# EAGLE design Spectra Mirror Top Board Final (EAGLE 6.5.0)
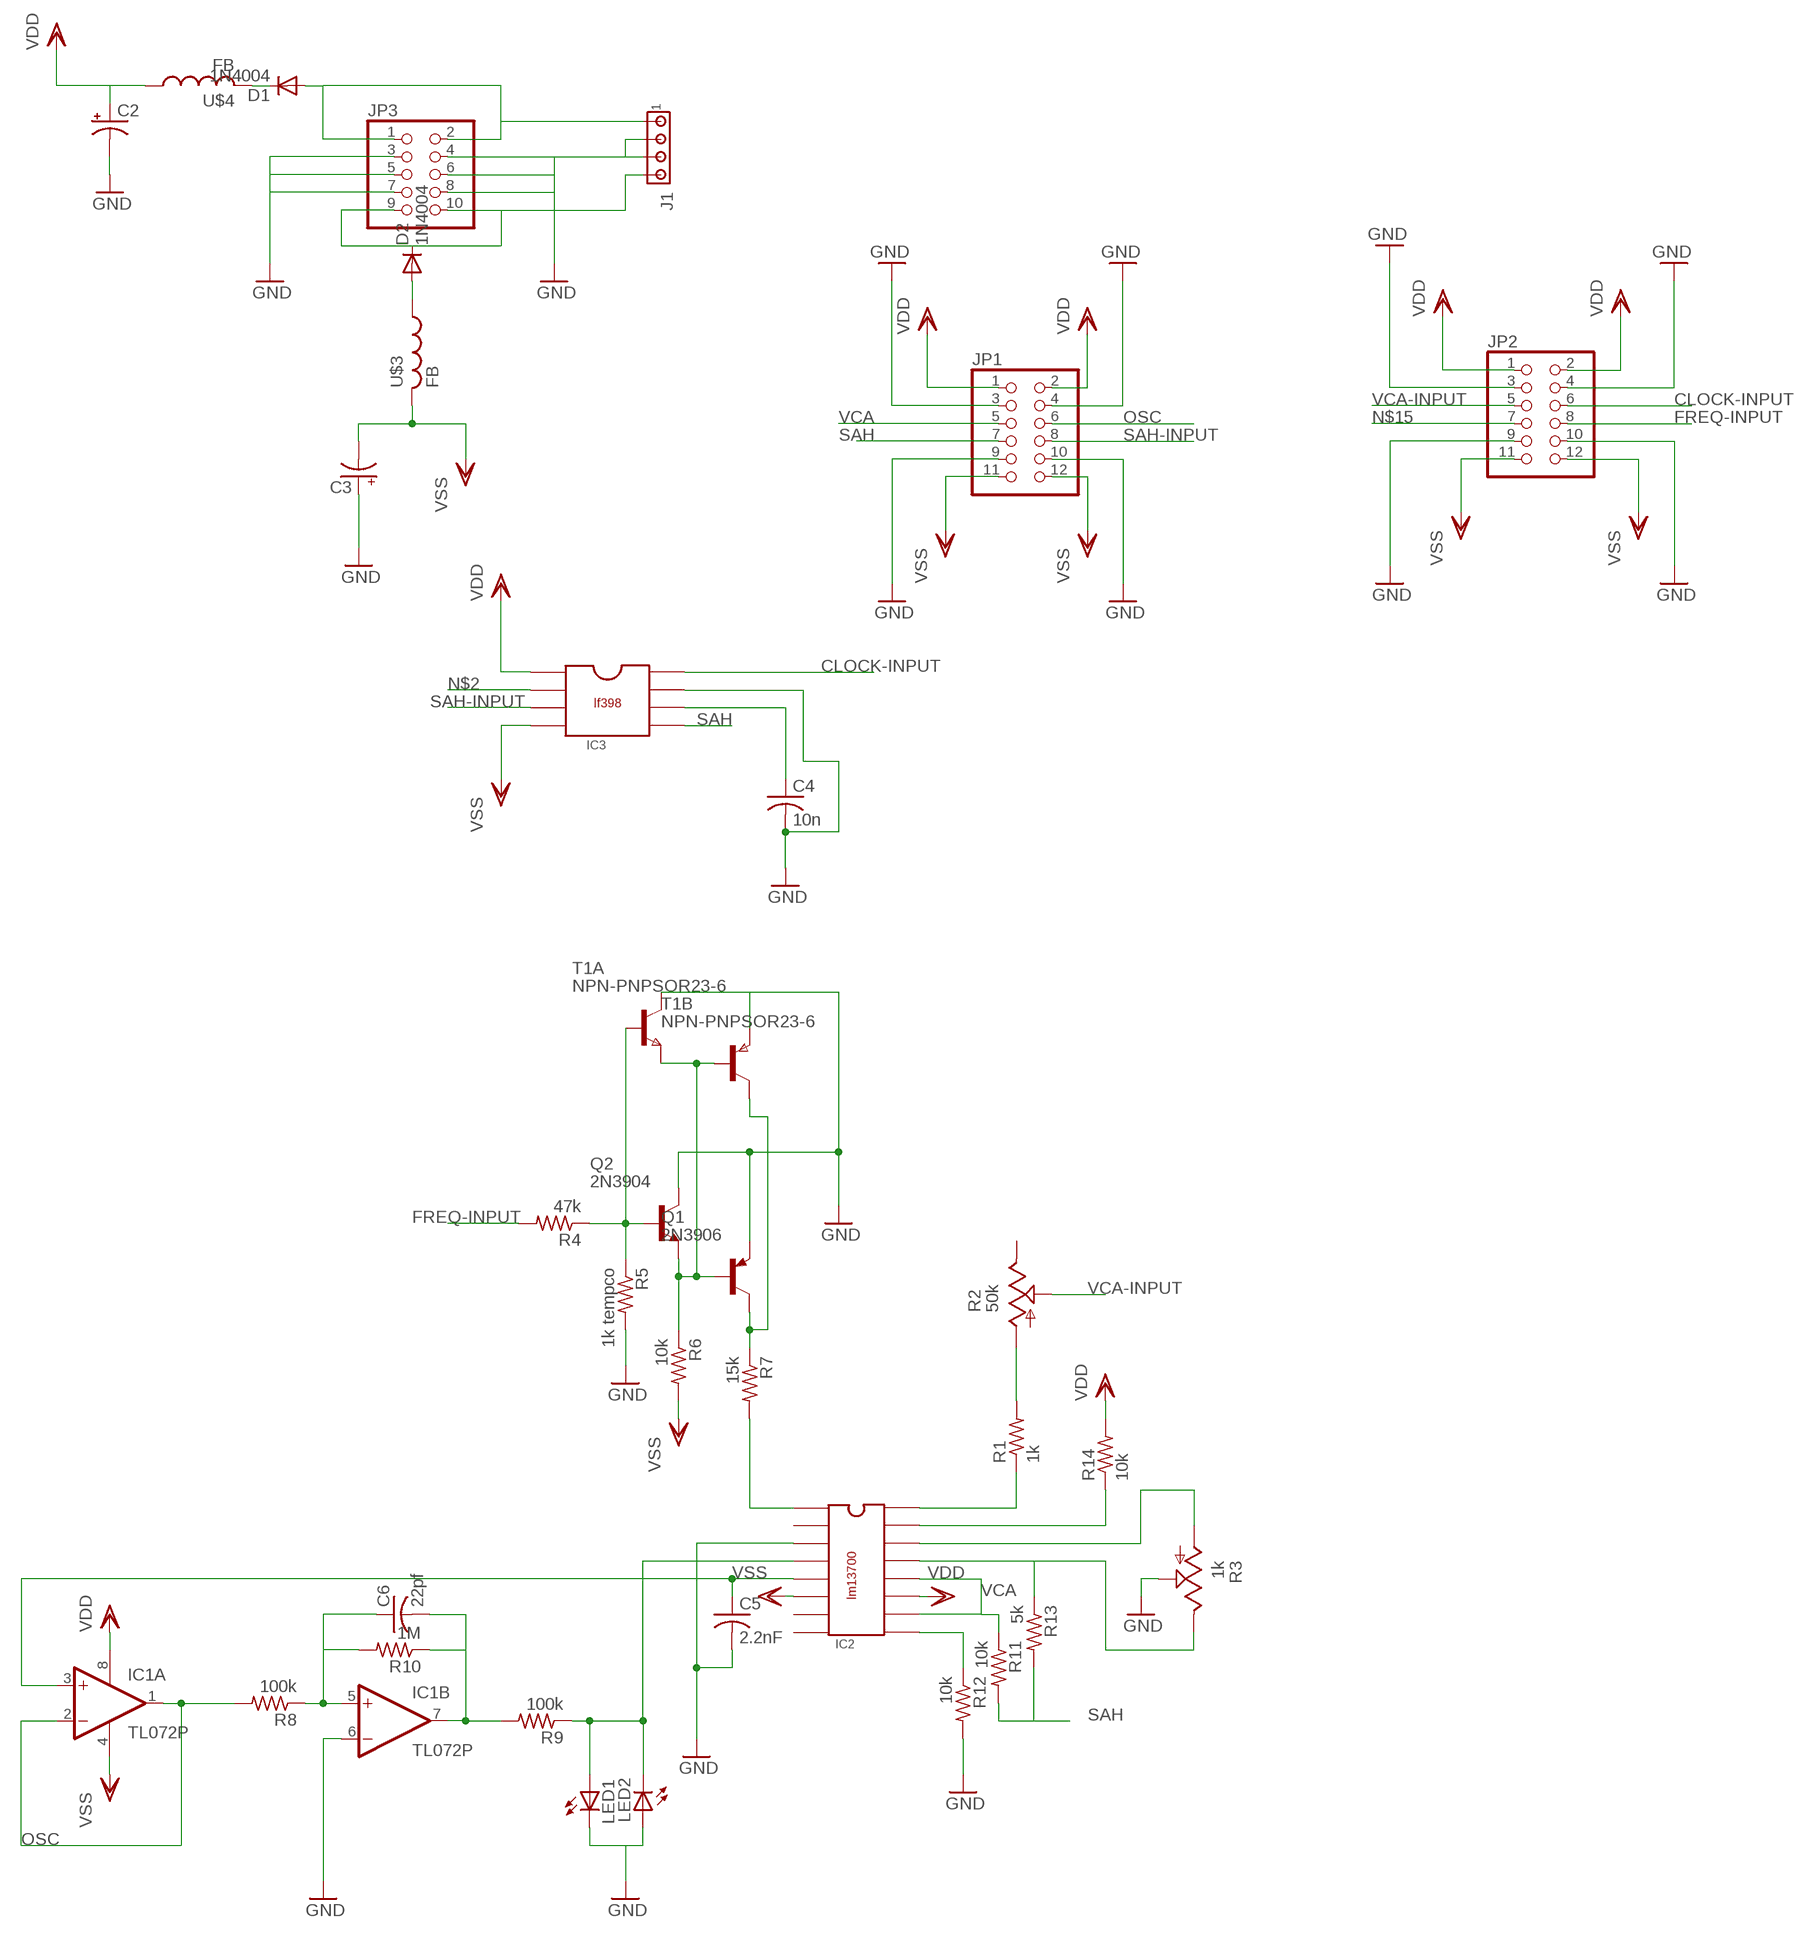
[diagram p0: schematic, sheet 1]

## Parts
C2  CPOL-USE2.5-5  [E2,5-5]
C3  CPOL-USE2.5-5  [E2,5-5]
C4  10n  C-US050-024X044  [C050-024X044]
C5  2.2nF  C-US050-024X044  [C050-024X044]
C6  22pf  C-US050-024X044  [C050-024X044]
D1  1N4004  [DO41-10]
D2  1N4004  [DO41-10]
IC1  TL072P  [DIL08]
IC2  LM13700  [DIL16]
IC3  LF398  [DIL08]
J1  MTA04-156  [1X4MTA]
JP1  PINHD-2X6  [2X06]
JP2  PINHD-2X6  [2X06]
JP3  PINHD-2X5  [2X05]
LED1  LED3MM  [LED3MM]
LED2  LED3MM  [LED3MM]
Q1  2N3906  [TO92]
Q2  2N3904  [TO92]
R1  1k  R-US_0204/7  [0204/7]
R2  50k  TRIM_US-B64Y  [B64Y]
R3  1k  TRIM_US-B64Y  [B64Y]
R4  47k  R-US_0204/7  [0204/7]
R5  1k tempco  R-US_0204/7  [0204/7]
R6  10k  R-US_0204/7  [0204/7]
R7  15k  R-US_0204/7  [0204/7]
R8  100k  R-US_0204/7  [0204/7]
R9  100k  R-US_0204/7  [0204/7]
R10  1M  R-US_0204/7  [0204/7]
R11  10k  R-US_0204/7  [0204/7]
R12  10k  R-US_0204/7  [0204/7]
R13  5k  R-US_0204/7  [0204/7]
R14  10k  R-US_0204/7  [0204/7]
T1  NPN-PNPSOR23-6  [SOT23-6]
U$3  FB  [FB]
U$4  FB  [FB]

## Nets
CLOCK-INPUT: IC3.8 JP2.6
FREQ-INPUT: JP2.8 R4.2
GND: C2.- C3.+ C4.2 C5.2 IC1.6(B:-IN) IC2.3 IC3.7 J1.2 J1.3 JP1.3 JP1.4 JP1.9 JP1.10 JP2.3 JP2.4 JP2.9 JP2.10 JP3.3 JP3.4 JP3.5 JP3.6 JP3.7 JP3.8 LED1.K(C) LED2.A Q1.3(E) Q2.1(C) R3.S R5.2 R12.2 T1.1(A:C) T1.4(B:E)
N$1: D1.A J1.1 JP3.1 JP3.2
N$2: IC3.2
N$3: Q1.2(B) Q2.3(E) R6.1 T1.5(B:B) T1.6(A:E)
N$4: Q2.2(B) R4.1 R5.1 T1.2(A:B)
N$5: C4.1 IC3.6
N$6: C6.1 IC1.5(B:+IN) R8.1 R10.2
N$8: Q1.1(C) R7.1 T1.3(B:C)
N$9: IC2.1 R7.2
N$10: IC2.4 LED1.A LED2.K(C) R9.1
N$11: C6.2 IC1.7(B:OUT) R9.2 R10.1
N$12: D2.C J1.4 JP3.9 JP3.10
N$13: C5.1 IC1.3(A:+IN) IC2.5
N$14: IC2.9 R12.1
N$15: JP2.7
N$16: IC2.13 R3.E R13.1
N$17: IC2.14 R3.A
N$18: IC2.15 R14.1
N$19: IC2.16 R1.1
N$20: R1.2 R2.A
N$21: D1.C U$4.P$2
N$22: D2.A U$3.P$1
OSC: IC1.1(A:OUT) IC1.2(A:-IN) JP1.6 R8.2
SAH: IC3.5 JP1.7 R11.2 R13.2
SAH-INPUT: IC3.3 JP1.8
VCA: IC2.10 IC2.12 JP1.5 R11.1
VCA-INPUT: JP2.5 R2.S
VDD: C2.+ IC1.8(P:V+) IC2.11 IC3.1 JP1.1 JP1.2 JP2.1 JP2.2 R14.2 U$4.P$1
VSS: C3.- IC1.4(P:V-) IC2.6 IC3.4 JP1.11 JP1.12 JP2.11 JP2.12 R6.2 U$3.P$2
Unconnected: IC2.2 IC2.7 IC2.8 R2.E

## Library data of the parts
C2 C3 = rcl:CPOL-US: POLARIZED CAPACITOR, American symbol
C4-C6 = rcl:C-US: CAPACITOR, American symbol
D1 D2 = diode:1N4004: DIODE general purpose rectifier, 1 A
IC1 = linear:TL072: OP AMP
IC2 = elipech_modified:LM13700
IC3 = elipech_modified:LF398
J1 = con-amp:MTA04-156: AMP connector
JP1 JP2 = pinhead:PINHD-2X6: PIN HEADER
JP3 = pinhead:PINHD-2X5: PIN HEADER
LED1 LED2 = adafruit:LED: LED OSRAM: - CHIPLED LG R971, LG N971, LY N971, LG Q971, LY Q971, LO R971, LY R971 LH N974, LH R974 LS Q976, LO Q976, LY Q976 LO Q996 - Hyper CHIPLED LW Q18S LB Q993, LB Q99A, LB R99A - SideLED LS A670, LO A670, LY A670, LG A670, LP A670 LB A673, LV A673, LT A673, LW A673 LH A674 LY A675 LS A676, LA A676, LO A676, LY A676, LW A676 LS A679, LY A679, LG A679 - Hyper Micro SIDELED® LS Y876, LA Y876, LO Y876, LY Y876 LT Y87S - SmartLED LW L88C, LW L88S LB L89C, LB L89S, LG L890 LS L89K, LO L89K, LY L89K LS L896, LA L896, LO L896, LY L896 - TOPLED LS T670, LO T670, LY T670, LG T670, LP T670 LSG T670, LSP T670, LSY T670, LOP T670, LYG T670 LG T671, LOG T671, LSG T671 LB T673, LV T673, LT T673, LW T673 LH T674 LS T676, LA T676, LO T676, LY T676, LB T676, LH T676, LSB T676, LW T676 LB T67C, LV T67C, LT T67C, LS T67K, LO T67K, LY T67K, LW E67C LS E67B, LA E67B, LO E67B, LY E67B, LB E67C, LV E67C, LT E67C LW T67C LS T679, LY T679, LG T679 LS T770, LO T770, LY T770, LG T770, LP T770 LB T773, LV T773, LT T773, LW T773 LH T774 LS E675, LA E675, LY E675, LS T675 LS T776, LA T776, LO T776, LY T776, LB T776 LHGB T686 LT T68C, LB T68C - Hyper Mini TOPLED® LB M676 - Mini TOPLED Santana® LG M470 LS M47K, LO M47K, LY M47K Source: http://www.osram.convergy.de/
Q1 = transistor-pnp:2N3906: PNP Transistor
Q2 = transistor:2N3904: NPN TRANSISTOR
R1 R4-R14 = rcl:R-US_: RESISTOR, American symbol
R2 R3 = pot:TRIM_US-: POTENTIOMETER
T1 = zetex:NPN-PNPSOR23-6: Dual NPN PNP TRANSISTOR; OC_FARNELL: unknown; OC_NEWARK: unknown
U$3 U$4 = adafruit:FB: Ferrite bead Digikey #P9821BK-ND

## Board
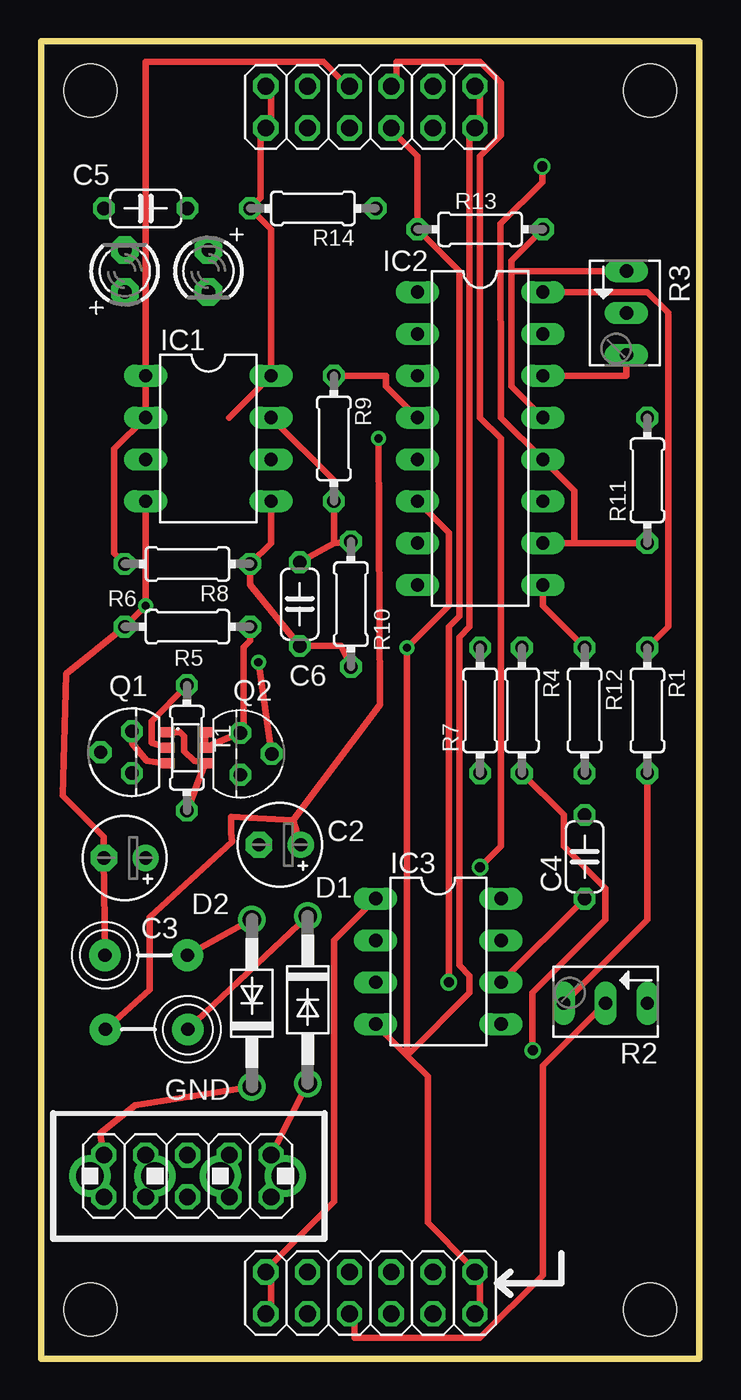
[diagram p1: board, top side]
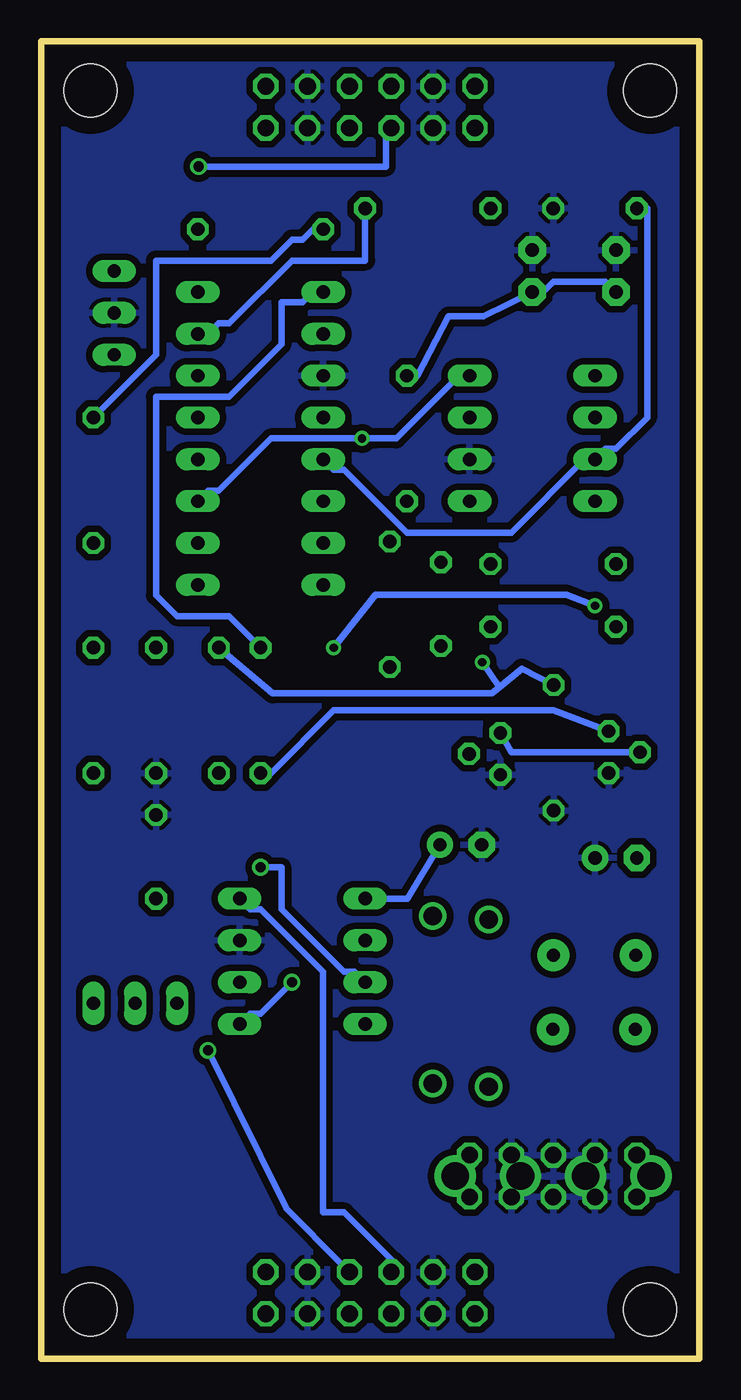
[diagram p2: board, bottom side, seen from below]

Size 40 x 80 mm. Coordinates in mm from the lower left corner, seen from the top.
Outline: 0,0 40,0 40,80 0,80 0,0
Copper layers (1*16): Top 0.035mm / dielectric 1.5mm / Bottom 0.035mm
Design rules "default *": minimum track width 10mil, minimum drill 24mil, track to track 8mil, track to pad 8mil, pad to pad 8mil, via to via 8mil, smd to smd 8mil, copper to edge 40mil, drill to drill 8mil, minimum pad ring 10mil, minimum via ring 8mil, stop-mask expansion 4mil, vias tented up to drill 25mil, thermal gap 10mil
Holes 3.2 mm at 3,3 37,3 3,77 37,77

### Footprints (pad centres in the part's own frame; a part is rotated, then mirrored left to right if it is on the bottom)
E2,5-5 = drill 0.813 pad 1.6: + -1.27,0 | drill 0.813 pad 1.6 octagon: - 1.27,0
C050-024X044 = drill 0.813 octagon: 1 -2.54,0; 2 2.54,0
DO41-10 = drill 1.118: A 5.08,0; C -5.08,0
DIL08 = drill 0.813 pad 1.27 long: 1 -3.81,-3.81; 2 -1.27,-3.81; 3 1.27,-3.81; 4 3.81,-3.81; 5 3.81,3.81; 6 1.27,3.81; 7 -1.27,3.81; 8 -3.81,3.81
DIL16 = drill 0.813 long: 1 -8.89,-3.81; 2 -6.35,-3.81; 3 -3.81,-3.81; 4 -1.27,-3.81; 5 1.27,-3.81; 6 3.81,-3.81; 7 6.35,-3.81; 8 8.89,-3.81; 9 8.89,3.81; 10 6.35,3.81; 11 3.81,3.81; 12 1.27,3.81; 13 -1.27,3.81; 14 -3.81,3.81; 15 -6.35,3.81; 16 -8.89,3.81
1X4MTA = drill 1.676: 1 5.944,0; 2 1.981,0; 3 -1.981,0; 4 -5.944,0
2X06 = drill 1.016 octagon: 1 -6.35,-1.27; 2 -6.35,1.27; 3 -3.81,-1.27; 4 -3.81,1.27; 5 -1.27,-1.27; 6 -1.27,1.27; 7 1.27,-1.27; 8 1.27,1.27; 9 3.81,-1.27; 10 3.81,1.27; 11 6.35,-1.27; 12 6.35,1.27
2X05 = drill 1.016 octagon: 1 -5.08,-1.27; 2 -5.08,1.27; 3 -2.54,-1.27; 4 -2.54,1.27; 5 0,-1.27; 6 0,1.27; 7 2.54,-1.27; 8 2.54,1.27; 9 5.08,-1.27; 10 5.08,1.27
LED3MM = drill 0.813 pad 1.676 octagon: A -1.27,0; K 1.27,0
TO92 = drill 0.813 octagon: 1 1.27,0; 2 0,1.905; 3 -1.27,0
0204/7 = drill 0.813 octagon: 1 -3.81,0; 2 3.81,0
B64Y = drill 0.813 long: A 2.54,0; E -2.54,0; S 0,0
SOT23-6 = smd 0.6 x 0.9: 1 -0.95,-1.15; 2 0,-1.15; 3 0.95,-1.15; 4 0.95,1.15; 5 0,1.15; 6 -0.95,1.15
FB = drill 0.8 pad 1.93: P$1 -2.5,0; P$2 2.5,0

### Placement (x,y rotation side)
C2  14.5,31.21 180 top
C3  5.08,30.41 180 top
C4  33.02,30.48 90 top
C5  6.35,69.85 0 top
C6  15.71,45.82 90 top
D1  16.2,21.8 270 top
D2  12.8,21.6 90 top
IC1  10.16,55.88 270 top
IC2  26.67,55.88 270 top
IC3  24.13,24.13 270 top
J1  8.9,11.1 0 top
JP1  20,76 0 top
JP2  20,4 0 top
JP3  8.89,11.1 180 top
LED1  5.08,66.04 90 top
LED2  10.16,66.04 270 top
Q1  5.52,36.83 90 top
Q2  12.1,36.73 270 top
R1  36.83,39.37 270 top
R2  34.29,21.59 180 top
R3  35.56,63.5 270 top
R4  29.21,39.37 270 top
R5  8.86,37.1 270 top
R6  8.89,44.45 180 top
R7  26.67,39.37 90 top
R8  8.89,48.26 180 top
R9  17.78,55.88 270 top
R10  18.82,45.82 270 top
R11  36.83,53.34 90 top
R12  33.02,39.37 270 top
R13  26.67,68.58 180 top
R14  16.51,69.85 180 top
T1  8.8,37.1 270 top
U$3  6.38,24.51 180 top
U$4  6.41,20 0 top

### Tracks (layer width: path | path; a pad name or v marks a point on that pad's centre or on a via)
CLOCK-INPUT
  Bottom 0.406: IC3.8 27.3,27.3 26.67,27.3 22.86,23.5 22.86,8.89 21.59,8.89 18.41,5.71 JP2.6
FREQ-INPUT  (via drill 0.61)
  Top 0.406: R4.2 31.75,33.02 31.75,31.11 34.29,28.57 34.29,26.67 29.84,22.23 29.84,19.2 v29.86,18.73
  Bottom 0.406: v29.86,18.73 25.1,9.1 21.71,5.71 20.95,5.71 JP2.8
GND
  Top 0.406: R5.2 T1.4 9.3,36.3 8.7,36.9 8.7,37.8 8.45,38.05 T1.1
  pour Bottom (isolate 0.406): -5.08,82.55 -5.08,-3.81 54.61,-3.81 54.61,24.13 54.61,83.82 -5.08,83.82
N$1
  Top 0.406: JP3.1 JP3.2 | D1.A JP3.1 | JP3.1 J1.1
N$3
  Top 0.406: R6.1 12.7,43.6 12.3,43.2 12.3,38.5 Q2.3 T1.5 T1.6
  Bottom 0.406: Q1.2 11.43,36.83 Q2.3
N$4  (via drill 0.5)
  Top 0.406: Q2.2 v13.2,42.3 | R5.1 6.7,38.7 6.7,37.4 T1.2
  Bottom 0.406: R4.1 25.93,40.41 12.6,40.41 12.15,40.78 | 12.15,40.78 10.79,41.91 R5.1 | v13.2,42.3 12.15,40.78
N$5
  Top 0.406: C4.1 IC3.6
N$6
  Top 0.406: R10.2 18.22,43.28 C6.1 12.7,46.99 R8.1 13.97,49.53 IC1.5
N$8
  Top 0.406: T1.3 7.37,36.15 6.4,36.3 5.52,37.38 Q1.1
  Bottom 0.406: R7.1 26.04,35.56 22.23,39.37 8.89,39.37 Q1.1
N$9
  Bottom 0.406: R7.2 28.57,45.09 31.75,45.09 33.02,46.35 33.02,58.42 28.57,58.42 25.4,61.59 25.4,64.14 24.13,64.14 23.5,64.77 IC2.1
N$10
  Top 0.406: R9.1 20.95,59.69 20.95,59.05 IC2.4
  Bottom 0.406: LED1.A 5.71,65.41 8.89,65.41 9.53,64.77 LED2.K 13.13,63.3 15.24,63.3 17.14,59.69 R9.1
N$11
  Top 0.406: 17.78,49.53 C6.2 | 17.78,49.53 R9.2 17.78,53.34 IC1.7 | 17.78,49.53 R10.1
N$12
  Top 0.406: D2.C 5.7,15.4 3.6,13.7 JP3.9 | JP3.9 JP3.10 | JP3.9 J1.4
N$13
  Bottom 0.406: C5.1 3.17,69.85 3.17,57.15 5.08,55.24 5.71,55.24 IC1.3 6.99,54.61 11.43,50.16 17.78,50.16 21.59,53.98 22.23,53.98 IC2.5
N$14
  Top 0.406: R12.1 30.48,45.72 IC2.9
N$16
  Top 0.406: IC2.13 28.57,59.05 28.57,66.04 | 28.57,66.04 28.57,66.67 R13.1 | 28.57,66.04 R3.E
N$17
  Top 0.406: IC2.14 35.56,59.69 R3.A
N$18
  Bottom 0.406: R14.1 20.32,66.67 24.77,66.67 28.57,62.87 29.21,62.87 29.84,62.23 IC2.15
N$19
  Top 0.406: R1.1 38.1,44.45 38.1,63.5 36.83,64.77 IC2.16
N$20
  Top 0.406: R2.A 36.83,26.67 R1.2
N$21
  Top 0.406: D1.C U$4.P$2
N$22
  Top 0.406: U$3.P$1 D2.A
OSC
  Top 0.406: R8.2 4.45,48.9 4.45,55.24 IC1.2 IC1.1 6.35,78.74 17.14,78.74 18.41,77.47 JP1.6
SAH  (via drill 0.61)
  Top 0.406: v24.77,22.86 24.77,44.45 25.4,45.09 25.4,66.04 R13.2 22.86,73.03 21.59,74.3 JP1.7
  Bottom 0.406: IC3.5 27.3,20.95 26.67,20.95 v24.77,22.86 | R11.2 33.02,60.96 33.02,66.67 26.04,66.67 24.77,67.94 24.13,67.94 23.5,68.58 R13.2
SAH-INPUT  (via drill 0.61)
  Top 0.406: v26.67,29.84 27.94,31.11 27.94,55.88 26.67,57.15 26.67,73.03 27.94,74.3 27.94,77.47 26.67,78.74 21.59,78.74 21.59,77.47 JP1.8
  Bottom 0.406: IC3.3 20.95,23.5 21.59,23.5 25.4,27.3 25.4,29.84 v26.67,29.84
VCA  (via drill 0.61)
  Top 0.406: R11.1 32.38,49.53 | 32.38,49.53 IC2.10 | 32.38,49.53 32.38,52.7 IC2.12 27.94,57.15 27.9,68.9 30.44,71.44 v30.44,72.39
  Bottom 0.406: v30.44,72.39 19.05,72.39 19.05,74.3 JP1.5
VCA-INPUT
  Top 0.406: R2.S 30.48,17.78 30.48,5.08 26.67,1.27 19.05,1.27 19.05,2.54 JP2.5
VDD  (via drill 0.5)
  Top 0.406: IC3.1 17.78,25.4 17.78,9.53 13.97,5.71 JP2.2 13.97,5.08 13.97,3.17 JP2.1 | JP1.2 13.97,76.83 13.97,74.93 JP1.1 13.34,74.3 13.34,70.48 R14.2 13.97,68.58 IC1.8 11.43,57.15 | U$4.P$1 6.6,22.4 6.6,26.8 11.59,31.39 11.53,31.95 11.53,32.9 15.3,32.7 | C2.+ 15.3,32.7 | 15.3,32.7 20.6,39.7 v20.5,55.88
  Bottom 0.406: C2.+ 17.74,27.94 IC3.1 | IC2.11 29.84,52.7 29.21,52.7 26.04,55.88 v20.5,55.88 19.7,55.88 18.41,55.88 14.61,59.69 IC1.8
VSS  (via drill 0.5)
  Top 0.406: IC1.4 v6.35,45.72 R6.2 1.51,41.58 1.3,34.2 3.81,31.69 C3.- U$3.P$2 | JP1.12 26.67,76.83 26.67,74.93 JP1.11 26.04,74.3 26.04,44.45 25.4,43.81 25.4,23.89 26.04,23.26 26.04,22.23 22.23,18.41 | 22.23,18.41 23.5,17.14 23.5,8.26 26.04,5.71 JP2.12 26.67,5.08 26.67,3.17 JP2.11 | 22.23,18.41 IC3.4 | IC2.6 24.77,50.16 24.77,45.72 v22.23,43.18 22.23,18.41
  Bottom 0.406: v6.35,45.72 8.1,46.4 19.7,46.4 v22.23,43.18

### Text on the board
tPlace: GND
tValues: SOLDER THIS SIDE | OFFSET | www.circuitshaman.com | 1k TC | GAIN | -12 | 23B: SPECTRA MIRROR | Designed by Eli Pechman | VCO core by Andrew F | Modded by Jessica Kedzig | All Rights Reserved | +12 | SOLDER THIS SIDE | REV 1